# EAGLE design VMCustom (EAGLE 6.5.0)
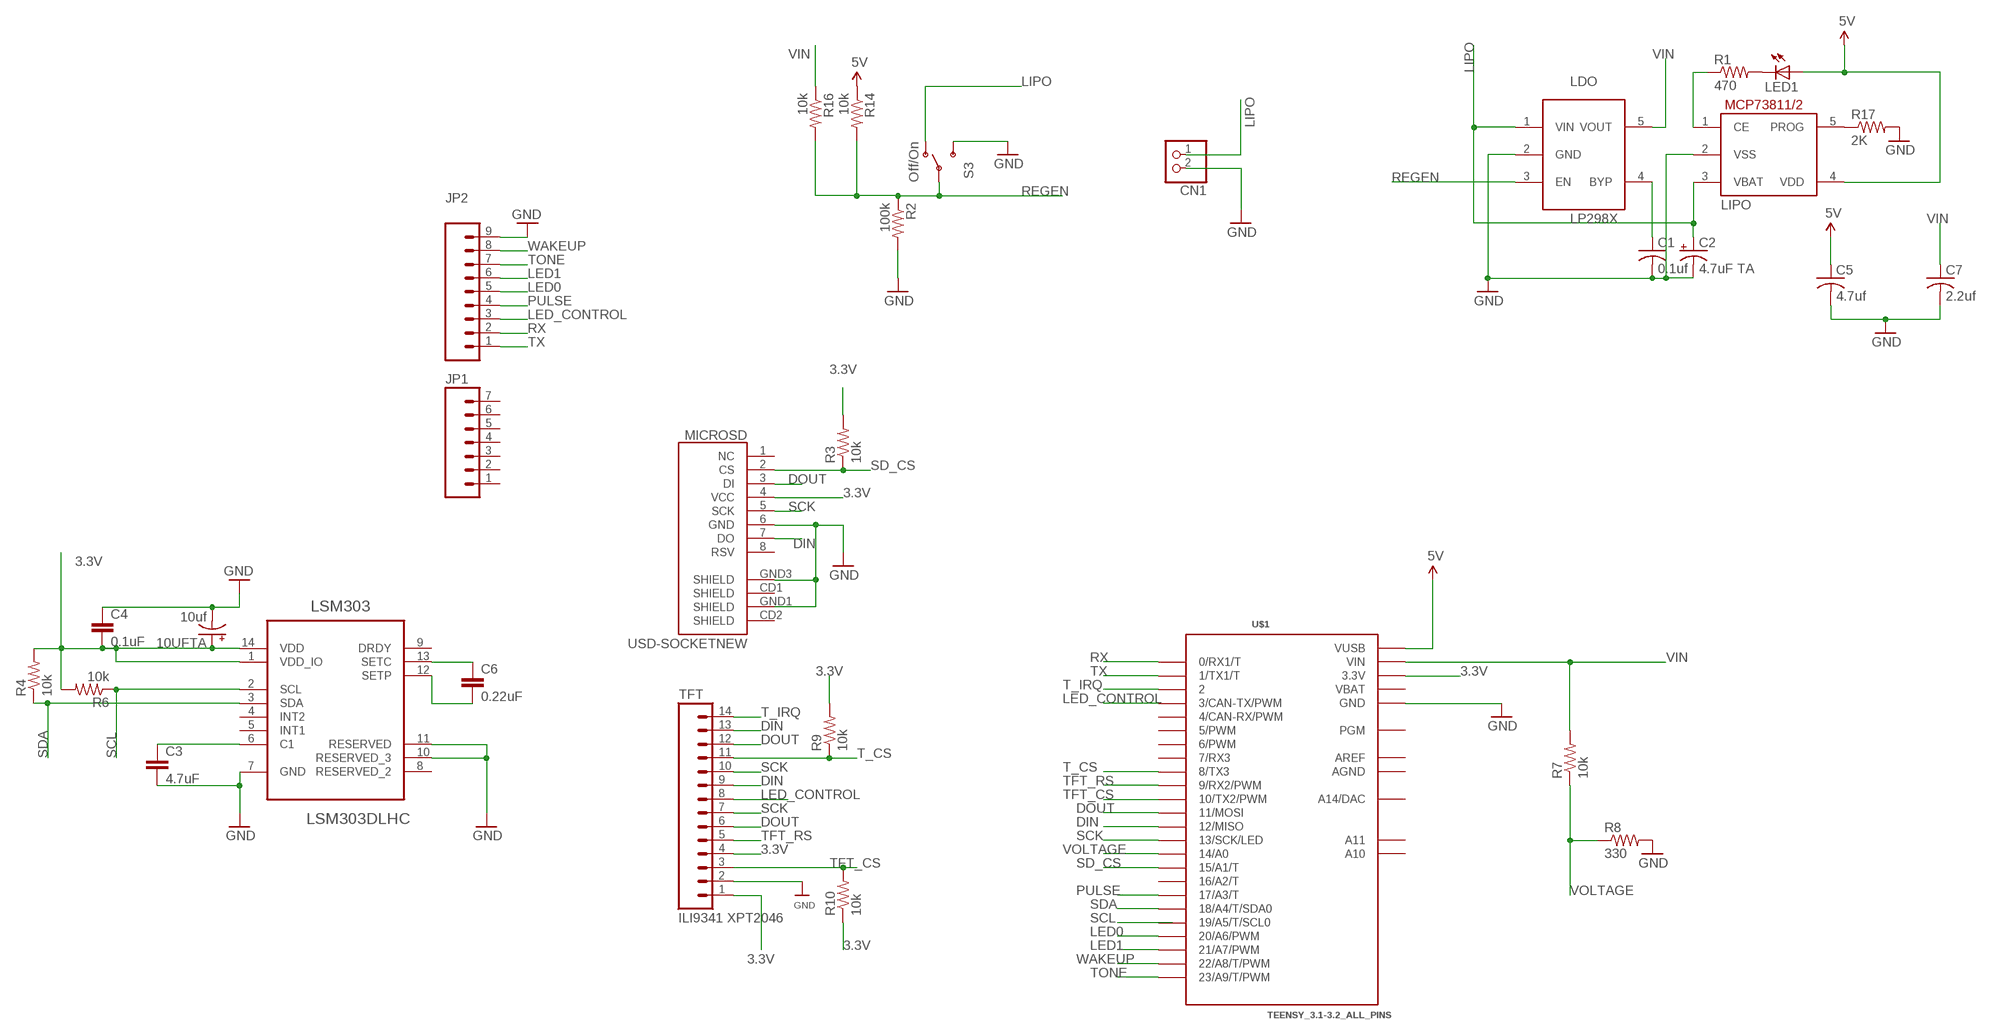
[diagram p0: schematic, sheet 1]

## Parts
10UFTA  10uf  CAP_POL6032  [EIA6032]
C1  0.1uf  C-USC0805K  [C0805K]
C2  4.7uF TA  10UF-16V-10%(TANT)  [EIA3216]
C3  4.7uF  CAP0805  [0805]
C4  0.1uF  CAP0805  [0805]
C5  4.7uf  C-USC0805K  [C0805K]
C6  0.22uF  CAP0805  [0805]
C7  2.2uf  C-USC0805K  [C0805K]
CN1  JST_2PIN-THM  [JST-PH-2-THM]
JP1  M07  [1X07]
JP2  M09NO_SILK  [1X09_NO_SILK]
LDO  LP298XS  [SOT23-5L]
LED1  LEDCHIPLED_0805  [CHIPLED_0805]
LIPO  MCP73811/2  [SOT23-5L]
LSM303  LSM303DLHC  [LGA14R80P1X6]
MICROSD  USD-SOCKETNEW  [MICRO-SD-SOCKET-PP]
R1  470  R-US_M0805  [M0805]
R2  100k  R-US_R0805  [R0805]
R3  10k  RESISTOR0805-RES  [0805]
R4  10k  RESISTOR0805-RES  [0805]
R6  10k  RESISTOR0805-RES  [0805]
R7  10k  RESISTOR0805-RES  [0805]
R8  330  RESISTOR0805-RES  [0805]
R9  10k  RESISTOR0805-RES  [0805]
R10  10k  RESISTOR0805-RES  [0805]
R14  10k  R-US_R0805  [R0805]
R16  10k  R-US_R0805  [R0805]
R17  2K  R-US_M0805  [M0805]
S3  Off/On  SWITCH-SPDT-SMD-A  [SWITCH-SPST-SMD-A]
TFT  ILI9341 XPT2046  M14  [1X14]
U$1  TEENSY_3.1-3.2_ALL_PINS  [TEENSY_3.0-3.2&LC_ALL_PINS]

## Nets
3.3V: 10UFTA.P$1(+) C4.2 LSM303.1(VDD_IO) LSM303.14(VDD) MICROSD.4(VCC) R3.2 R4.2 R6.2 R9.2 R10.1 TFT.1 TFT.4 U$1.3.3V U$1.3.3V1(3.3V)
5V [power]: C5.1 LED1.A LIPO.4(VDD) R14.1 U$1.VUSB
DIN: MICROSD.7(DO) TFT.9 TFT.13 U$1.12(12/MISO)
DOUT: MICROSD.3(DI) TFT.6 TFT.12 U$1.11(11/MOSI)
GND: 10UFTA.P$2(-) C1.2 C2.C(-) C3.2 C4.1 C5.2 C7.2 CN1.2 JP2.9 LDO.2(GND) LIPO.2(VSS) LSM303.7(GND) LSM303.10(RESERVED_3) LSM303.11(RESERVED) MICROSD.6(GND) MICROSD.GND1(SHIELD) MICROSD.GND3(SHIELD) R2.2 R8.2 R17.2 S3.3(S) TFT.2 U$1.GND U$1.GND1(GND)
LED0: JP2.5 U$1.20/A6(20/A6/PWM)
LED1: JP2.6 U$1.21/A7(21/A7/PWM)
LED_CONTROL: JP2.3 TFT.8 U$1.3(3/CAN-TX/PWM)
LIPO [power]: C2.A(+) CN1.1 LDO.1(VIN) LIPO.3(VBAT) S3.1(O)
N$1 [power]: LIPO.1(CE) R1.1
N$2: C3.1 LSM303.6(C1)
N$3: LED1.C R1.2
N$4: C1.1 LDO.4(BYP)
N$8: C6.1 LSM303.13(SETC)
N$10: C6.2 LSM303.12(SETP)
N$17 [power]: LIPO.5(PROG) R17.1
PULSE: JP2.4 U$1.17/A3(17/A3/T)
REGEN: LDO.3(EN) R2.1 R14.2 R16.2 S3.2(P)
RX: JP2.2 U$1.0(0/RX1/T)
SCK: MICROSD.5(SCK) TFT.7 TFT.10 U$1.13(13/SCK/LED)
SCL: LSM303.2(SCL) R6.1 U$1.19/A5(19/A5/T/SCL0)
SD_CS: MICROSD.2(CS) R3.1 U$1.15/A1(15/A1/T)
SDA: LSM303.3(SDA) R4.1 U$1.18/A4(18/A4/T/SDA0)
T_CS: R9.1 TFT.11 U$1.8(8/TX3)
T_IRQ: TFT.14 U$1.2
TFT_CS: R10.2 TFT.3 U$1.10(10/TX2/PWM)
TFT_RS: TFT.5 U$1.9(9/RX2/PWM)
TONE: JP2.7 U$1.23/A9(23/A9/T/PWM)
TX: JP2.1 U$1.1(1/TX1/T)
VIN: C7.1 LDO.5(VOUT) R7.2 R16.1 U$1.VIN
VOLTAGE: R7.1 R8.1 U$1.14/A0
WAKEUP: JP2.8 U$1.22/A8(22/A8/T/PWM)
Unconnected: JP1.1 JP1.2 JP1.3 JP1.4 JP1.5 JP1.6 JP1.7 LSM303.4(INT2) LSM303.5(INT1) LSM303.8(RESERVED_2) LSM303.9(DRDY) MICROSD.1(NC) MICROSD.8(RSV) MICROSD.CD1(SHIELD) MICROSD.CD2(SHIELD) U$1.4(4/CAN-RX/PWM) U$1.5(5/PWM) U$1.6(6/PWM) U$1.7(7/RX3) U$1.16/A2(16/A2/T) U$1.A10 U$1.A11 U$1.PGM U$1.RESET/DAC(A14/DAC)

## Power pins joined to a net without a drawn wire
AGND: U$1.AGND
AREF: U$1.AREF
VBAT: U$1.VBAT

## Library data of the parts
10UFTA = SparkFun-Passives:CAP_POL: Capacitor Polarized These are standard SMD and PTH capacitors. Normally 10uF, 47uF, and 100uF in electrolytic and tantalum varieties. Always verify the external diameter of the through hole cap, it varies with capacity, voltage, and manufacturer. The EIA devices should be standard.
C1 C5 C7 = adafruit:C-US: CAPACITOR, American symbol
C2 = SparkFun-Capacitors:10UF-16V-10%(TANT): CAP-00811 1206/EIA-3216 Tantalum capacitor; PROD_ID: CAP-00811; VALUE: 10uF
C3 C4 C6 = SparkFun:CAP: Capacitor Standard 0603 ceramic capacitor, and 0.1" leaded capacitor.
CN1 = adafruit:JST_2PIN: JST 2-Pin Connectors of various flavors SMT-RA (S2B-PH-SM4) 4UConnector #17311 SMT (B2B-PH-SM4) THM-RA (S2B-PH) THM (B2B-PH)
JP1 = SparkFun-Connectors:M07: Header 7 Standard 7-pin 0.1" header. Use with straight break away headers (SKU : PRT-00116), right angle break away headers (PRT-00553), swiss pins (PRT-00743), machine pins (PRT-00117), and female headers (PRT-00115). NOTES ON THE VARIANTS LOCK and LOCK_LONGPADS... This footprint was designed to help hold the alignment of a through-hole component (i.e. 7-pin header) while soldering it into place. You may notice that each hole has been shifted either up or down by 0.005 of an inch from it's more standard position (which is usually a perfectly straight line). This slight alteration caused the pins (the squares in the middle) to touch the edges of the holes. Because they are alternating, it causes a "brace" to hold the header in place. 0.005 has proven to be the perfect amount of "off-center" position when using our standard breakaway headers. Although looks a little odd when you look at the bare footprint, once you have a header in there, the alteration is very hard to notice. Also, if you push a header all the way into place, it is covered up entirely on the bottom side. This idea of altering the position of holes to aid alignment will be further integrated into the Sparkfun Library for other footprints. It can help hold any component with 3 or more connection pins.
JP2 = SparkFun-Connectors:M09: Header 9 Standard 9-pin 0.1" header. Use with straight break away headers (SKU : PRT-00116), right angle break away headers (PRT-00553), swiss pins (PRT-00743), machine pins (PRT-00117), and female headers (PRT-00115).
LDO = adafruit:LP298X
LED1 = led:LED: LED OSRAM: - CHIPLED LG R971, LG N971, LY N971, LG Q971, LY Q971, LO R971, LY R971 LH N974, LH R974 LS Q976, LO Q976, LY Q976 LO Q996 - Hyper CHIPLED LW Q18S LB Q993, LB Q99A, LB R99A - SideLED LS A670, LO A670, LY A670, LG A670, LP A670 LB A673, LV A673, LT A673, LW A673 LH A674 LY A675 LS A676, LA A676, LO A676, LY A676, LW A676 LS A679, LY A679, LG A679 - Hyper Micro SIDELED® LS Y876, LA Y876, LO Y876, LY Y876 LT Y87S - SmartLED LW L88C, LW L88S LB L89C, LB L89S, LG L890 LS L89K, LO L89K, LY L89K LS L896, LA L896, LO L896, LY L896 - TOPLED LS T670, LO T670, LY T670, LG T670, LP T670 LSG T670, LSP T670, LSY T670, LOP T670, LYG T670 LG T671, LOG T671, LSG T671 LB T673, LV T673, LT T673, LW T673 LH T674 LS T676, LA T676, LO T676, LY T676, LB T676, LH T676, LSB T676, LW T676 LB T67C, LV T67C, LT T67C, LS T67K, LO T67K, LY T67K, LW E67C LS E67B, LA E67B, LO E67B, LY E67B, LB E67C, LV E67C, LT E67C LW T67C LS T679, LY T679, LG T679 LS T770, LO T770, LY T770, LG T770, LP T770 LB T773, LV T773, LT T773, LW T773 LH T774 LS E675, LA E675, LY E675, LS T675 LS T776, LA T776, LO T776, LY T776, LB T776 LHGB T686 LT T68C, LB T68C - Hyper Mini TOPLED® LB M676 - Mini TOPLED Santana® LG M470 LS M47K, LO M47K, LY M47K Source: http://www.osram.convergy.de LUXEON: - LUMILED® LXK2-PW12-R00, LXK2-PW12-S00, LXK2-PW14-U00, LXK2-PW14-V00 LXK2-PM12-R00, LXK2-PM12-S00, LXK2-PM14-U00 LXK2-PE12-Q00, LXK2-PE12-R00, LXK2-PE12-S00, LXK2-PE14-T00, LXK2-PE14-U00 LXK2-PB12-K00, LXK2-PB12-L00, LXK2-PB12-M00, LXK2-PB14-N00, LXK2-PB14-P00, LXK2-PB14-Q00 LXK2-PR12-L00, LXK2-PR12-M00, LXK2-PR14-Q00, LXK2-PR14-R00 LXK2-PD12-Q00, LXK2-PD12-R00, LXK2-PD12-S00 LXK2-PH12-R00, LXK2-PH12-S00 LXK2-PL12-P00, LXK2-PL12-Q00, LXK2-PL12-R00 Source: www.luxeon.com KINGBRIGHT: KA-3528ASYC Source: www.kingbright.com
LIPO = adafruit:MCP73811/2: MCP73811 and MCP73812 Simple, Miniature Single-Cell, Fully Integrated Li-Ion / Li-Polymer Charge Management Controllers SOT-23-5 package, no indicator LED but with adjustable current, small and very inexpensive
LSM303 = LGA14R8OP1X6:LSM303DLHC: SENSOR, 3 CH, ACCEL, MAG, MOD, 14LGA; MPN: LSM303DLHC; OC_FARNELL: 2068595; OC_NEWARK: 73T6648; PACKAGE: LGA-14; SUPPLIER: STMicroelectronics
MICROSD = SparkFun-Connectors:USD-SOCKET: microSD Socket Push-push type uSD socket. Schematic element and footprint production proven. Spark Fun Electronics SKU : PRT-00127. tDoc lines correctly indicate media card edge positions when inserting (unlocked, locked, depressed).
R1 R2 R14 R16 R17 = adafruit:R-US_: RESISTOR, American symbol
R3 R4 R6-R10 = SparkFun-Resistors:RESISTOR: Resistor Basic schematic elements and footprints for 0603, 1206, and PTH resistors.
S3 = SparkFun-Electromechanical:SWITCH-SPDT: SPDT Switch Simple slide switch, Spark Fun Electronics SKU : COM-00102 DPDT SMT slide switch, AYZ0202, SWCH-08179
TFT = SparkFun-Connectors:M14: Header 14 Standard 14-pin 0.1" header. Use with straight break away headers (SKU : PRT-00116), right angle break away headers (PRT-00553), swiss pins (PRT-00743), machine pins (PRT-00117), and female headers (PRT-00115).
U$1 = Teensy_3_and_LC_Series_Boards_v1.4:TEENSY_3.1-3.2_ALL_PINS: Footprint for Teensy 3.1 or 3.2 board using all through-holes, i.e. the entire perimeter plus the 4 through-holes inboard (A10,A11,AREF, VUSB)

## Net classes
1 power: width 0.356 mm, drill 0.406 mm, clearance 0.355 mm to class 0, clearance 0.355 mm

## Board
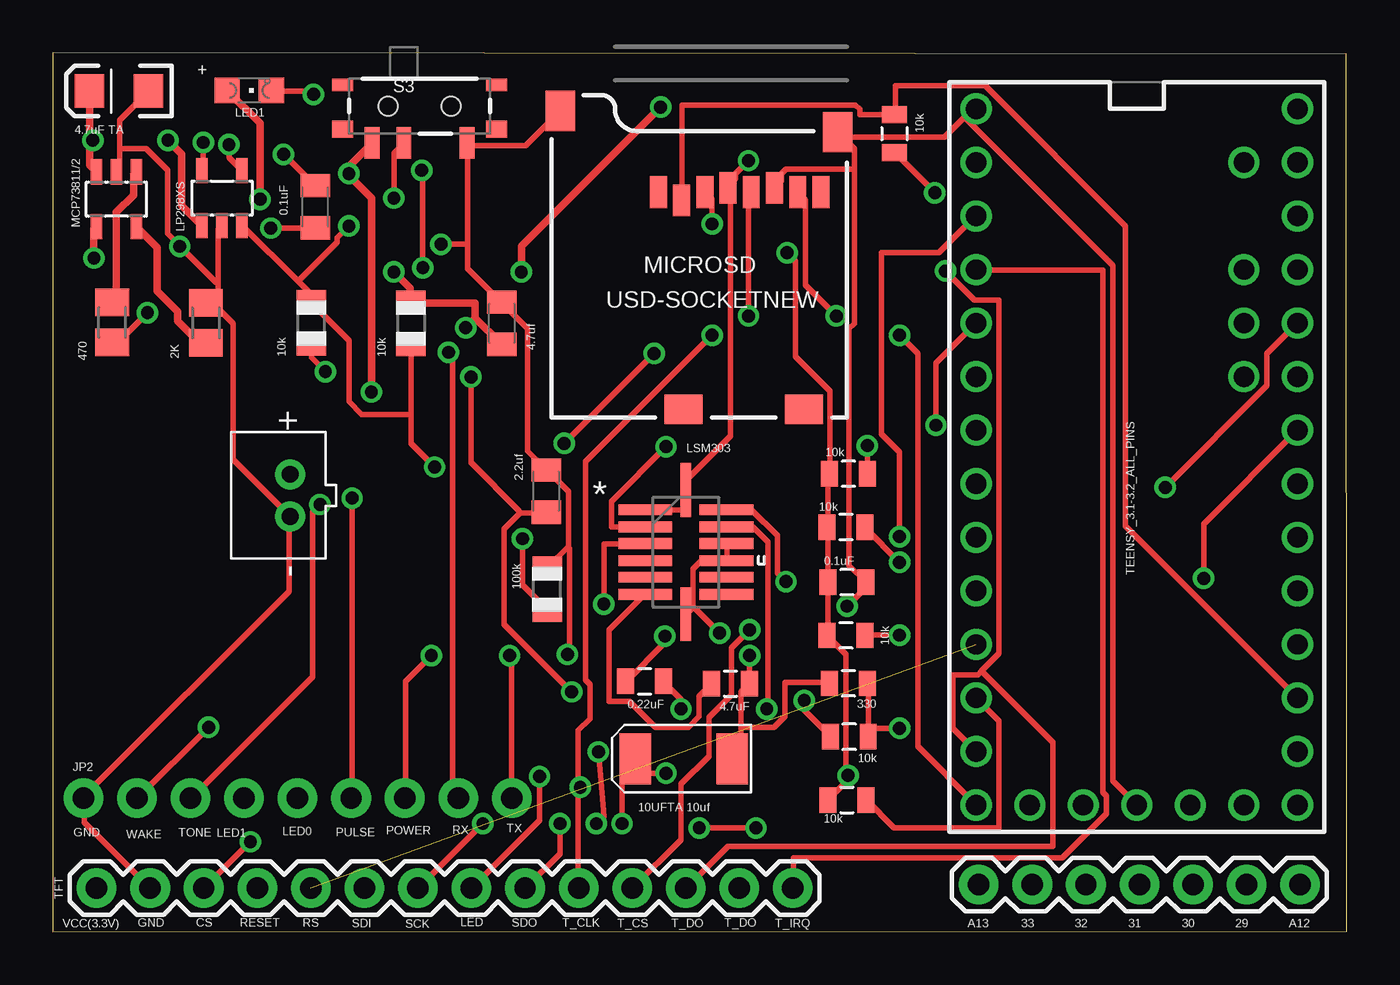
[diagram p1: board, top side]
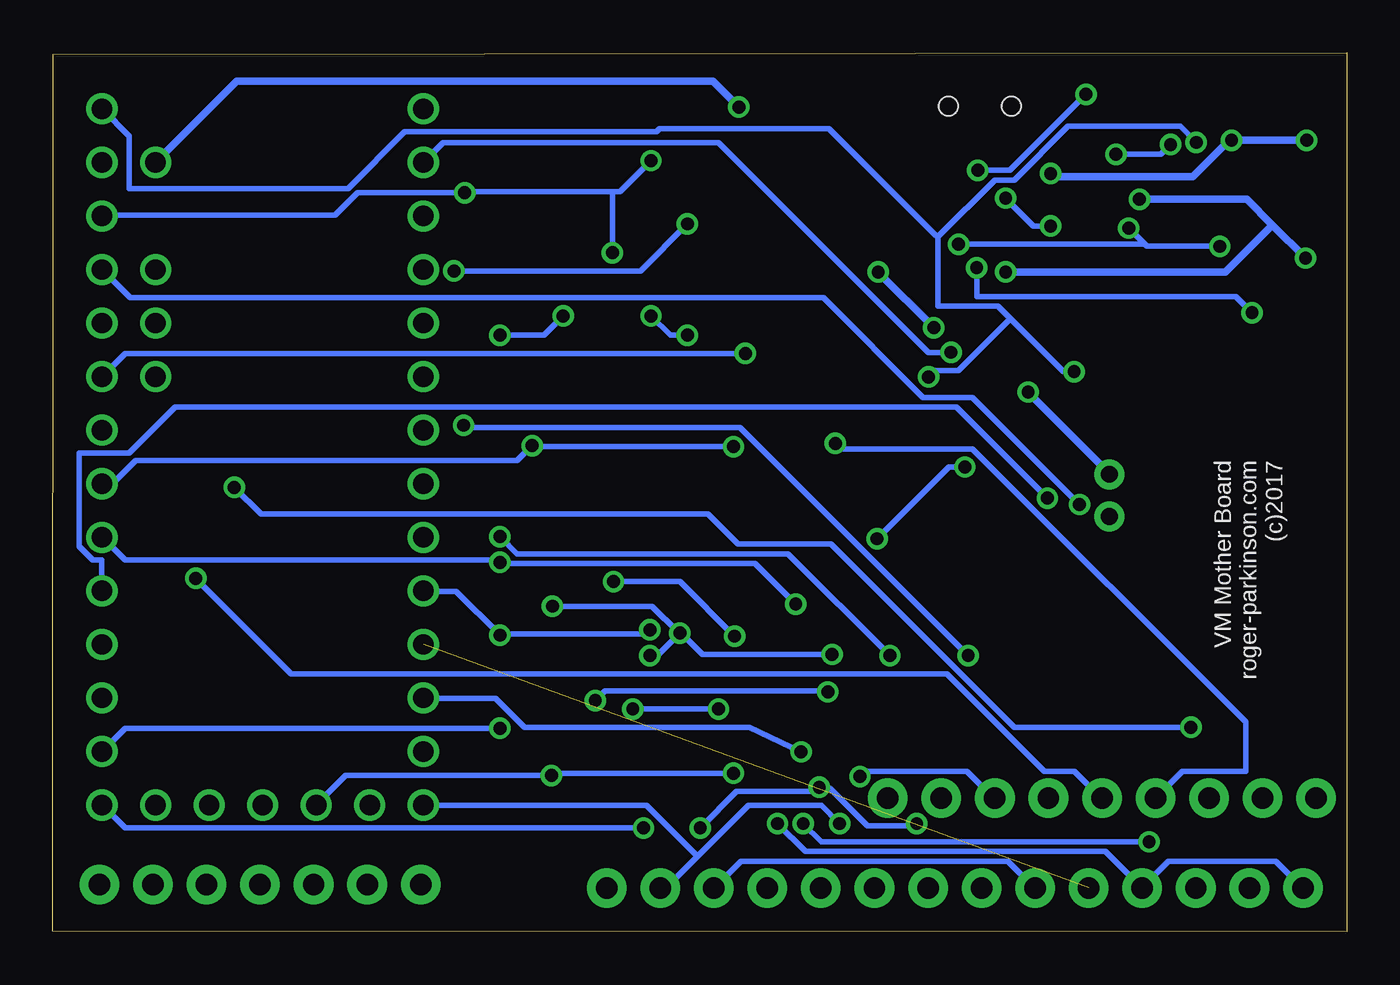
[diagram p2: board, bottom side, seen from below]

Size 61.37 x 41.7 mm. Coordinates in mm from the lower left corner, seen from the top.
Outline: 0,0 61.37,0.02 61.34,41.62 0,41.7 0,0
Copper layers (1*16): Top 0.035mm / dielectric 1.5mm / Bottom 0.035mm
Design rules "default": minimum track width 10mil, minimum drill 24mil, track to track 8mil, track to pad 8mil, pad to pad 8mil, via to via 8mil, smd to smd 8mil, copper to edge 40mil, drill to drill 8mil, minimum pad ring 10mil, minimum via ring 8mil, stop-mask expansion 4mil, vias tented up to drill 0mil, thermal gap 10mil

### Footprints (pad centres in the part's own frame; a part is rotated, then mirrored left to right if it is on the bottom)
EIA6032 = smd 1.5 x 2.4: P$1 -2.3,0; P$2 2.3,0
C0805K = smd 1.1 x 1.4: 1 -1,0; 2 1,0
EIA3216 = smd 1.4 x 1.6: A 1.4,0; C -1.4,0
0805 = smd 0.8 x 1.2: 1 -0.9,0; 2 0.9,0
JST-PH-2-THM = drill 0.8 pad 1.422: 1 1,0; 2 -1,0
1X07 = drill 1.016 pad 1.88: 1 0,0; 2 2.54,0; 3 5.08,0; 4 7.62,0; 5 10.16,0; 6 12.7,0; 7 15.24,0
1X09_NO_SILK = drill 1.016 pad 1.88: 1 0,0; 2 2.54,0; 3 5.08,0; 4 7.62,0; 5 10.16,0; 6 12.7,0; 7 15.24,0; 8 17.78,0; 9 20.32,0
SOT23-5L = smd 0.55 x 1.2: 1 -0.95,-1.3; 2 0,-1.3; 3 0.95,-1.3; 4 0.95,1.3; 5 -0.95,1.3
CHIPLED_0805 = smd 1.2 x 1.2: A 0,-1.05; C 0,1.05
LGA14R80P1X6 = smd 2.54 x 0.508: 1 -1.93,2.007; 2 -1.93,1.194; 3 -1.93,0.406; 4 -1.93,-0.406; 5 -1.93,-1.194; 6 -1.93,-2.007; 8 1.93,-2.007; 9 1.93,-1.194; 10 1.93,-0.406; 11 1.93,0.406; 12 1.93,1.194; 13 1.93,2.007 | smd 0.508 x 2.54: 7 0,-2.946; 14 0,2.946
MICRO-SD-SOCKET-PP = smd 0.8 x 1.5: 1 -8.94,10.7; 2 -7.84,10.3; 3 -6.74,10.7; 4 -5.64,10.9; 5 -4.54,10.7; 6 -3.44,10.9; 7 -2.34,10.7; 8 -1.24,10.7 | smd 1.8 x 1.4: CD1 -2.05,0.4; CD2 -7.75,0.4 | smd 1.4 x 1.9: GND1 -13.6,14.55; GND3 -0.45,13.55
M0805 = smd 1.3 x 1.6: 1 -0.95,0; 2 0.95,0
R0805 = smd 1.1 x 1.4: 1 -1,0; 2 1,0
SWITCH-SPST-SMD-A = smd 0.7 x 1.5: 1 -2.25,-1.75; 2 -0.75,-1.75; 3 2.25,-1.75 | smd 1 x 0.6: GND1 -3.65,1; GND3 3.65,1 | smd 1 x 0.8: GND2 -3.65,-1.1; GND4 3.65,-1.1 | hole 0.9: -1.5,0; 1.5,0
1X14 = drill 1.016 pad 1.88: 1 0,0; 2 2.54,0; 3 5.08,0; 4 7.62,0; 5 10.16,0; 6 12.7,0; 7 15.24,0; 8 17.78,0; 9 20.32,0; 10 22.86,0; 11 25.4,0; 12 27.94,0; 13 30.48,0; 14 33.02,0
TEENSY_3.0-3.2&LC_ALL_PINS = drill 0.965: 0 -7.62,13.97; 1 -7.62,11.43; 2 -7.62,8.89; 3 -7.62,6.35; 3.3V 7.62,11.43; 3.3V1 -2.54,-16.51; 4 -7.62,3.81; 5 -7.62,1.27; 6 -7.62,-1.27; 7 -7.62,-3.81; 8 -7.62,-6.35; 9 -7.62,-8.89; 10 -7.62,-11.43; 11 -7.62,-13.97; 12 -7.62,-16.51; 13 7.62,-16.51; 14/A0 7.62,-13.97; 15/A1 7.62,-11.43; 16/A2 7.62,-8.89; 17/A3 7.62,-6.35; 18/A4 7.62,-3.81; 19/A5 7.62,-1.27; 20/A6 7.62,1.27; 21/A7 7.62,3.81; 22/A8 7.62,6.35; 23/A9 7.62,8.89; A10 5.08,6.35; A11 5.08,3.81; AGND 7.62,13.97; AREF 5.08,8.89; GND -7.62,16.51; GND1 0,-16.51; PGM 2.54,-16.51; RESET/DAC 5.08,-16.51; VBAT -5.08,-16.51; VIN 7.62,16.51; VUSB 5.08,13.97

### Placement (x,y rotation side)
10UFTA  29.92,8.2 0 top
C1  12.45,34.39 270 top
C2  3.15,39.88 180 top
C3  32.14,11.77 0 top
C4  37.66,16.58 180 top
C5  21.3,28.86 90 top
C6  28.07,11.88 0 top
C7  23.4,20.9 90 top
CN1  11.25,20.7 90 top
JP1  43.92,2.24 0 top
JP2  21.77,6.33 180 top
LDO  8.03,34.8 0 top
LED1  9.32,39.9 270 top
LIPO  3.02,34.75 180 top
LSM303  30.02,18.01 0 top
MICROSD  37.67,24.38 0 top
R1  2.82,28.91 270 top
R2  23.44,16.26 90 top
R3  39.91,37.85 270 top
R4  37.62,19.19 180 top
R6  37.74,21.72 180 top
R7  37.77,9.25 180 top
R8  37.74,11.79 180 top
R9  37.61,14.05 180 top
R10  37.66,6.25 0 top
R14  16.99,28.85 270 top
R16  12.27,28.88 90 top
R17  7.26,28.88 90 top
S3  17.4,39.17 0 top
TFT  2.08,2.08 0 top
U$1  51.41,22.52 0 top

### Tracks (layer width: path | path; a pad name or v marks a point on that pad's centre or on a via)
3.3V  (via drill 0.61)
  Top 0.254: LSM303.1 29.95,20.02 29.95,20.88 LSM303.14 30.05,20.98 30.05,21.44 32.13,23.52 32.13,35.15 32.03,35.26 MICROSD.4 32.08,35.41 32.38,35.71 32.38,35.97 v32.99,36.58 | v41.83,35.05 39.95,36.93 R3.2 | 37.62,7.42 37.62,13.16 36.8,13.97 R9.2 36.75,14.07 36.75,16.56 C4.2 36.75,16.66 36.75,19.15 R4.2 36.75,19.3 36.75,21.64 36.8,21.69 R6.2 36.86,21.84 36.86,25.65 35.23,27.28 35.23,31.8 v34.82,32.21 | 37.62,7.42 37.62,7.11 36.8,6.3 R10.1 | v37.72,7.42 37.62,7.42 | v27,5.13 27,7.57 27.61,8.18 10UFTA.P$1 27.1,7.52 v29.08,7.52
  Bottom 0.254: U$1.3.3V 59,33.99 47.98,33.99 46.91,35.05 v41.83,35.05 41.73,35.1 34.82,35.1 | v32.99,36.58 34.47,35.1 34.82,35.1 | U$1.3.3V1 48.84,6.05 47.47,7.42 v37.72,7.42 37.62,7.47 37.57,7.52 v29.08,7.52 | v27,5.13 25.68,3.81 11.46,3.81 9.73,2.08 TFT.4 9.63,2.18 8.46,3.35 3.38,3.35 2.11,2.08 TFT.1 | v34.82,32.21 34.82,35.1
5V  (via drill 0.61)
  Top 0.356: v1.96,31.95 1.96,33.33 2.06,33.43 LIPO.4 | v9.83,34.75 9.83,38.35 8.31,39.88 LED1.A | 20.04,29.11 20.04,29.82 16.99,29.82 R14.1 16.94,30.02 16.94,30.53 v16.18,31.29 | 20.04,29.11 21.26,27.89 C5.1 | v28.83,39.12 22.22,32.51 v22.22,31.29 | 20.04,29.11 v19.58,28.65
  Bottom 0.356: 3.53,33.53 4.75,34.75 v9.83,34.75 | 3.53,33.53 v1.96,31.95 | v28.83,39.12 30.05,40.34 52.65,40.34 56.46,36.53 U$1.VUSB | v19.58,28.65 v22.22,31.29 | 3.53,33.53 5.77,31.29 v16.18,31.29
DIN  (via drill 0.61)
  Top 0.254: v24.05,5.13 24.05,3.71 22.43,2.08 TFT.9 | v37.16,29.21 35.69,30.68 35.69,34.7 35.33,35.05 MICROSD.7 | v40.16,28.3 41.02,27.43 41.02,8.79 43.76,6.05 U$1.12
  Bottom 0.254: v24.05,5.13 24.92,5.99 28.37,5.99 30.78,3.58 | 30.78,3.58 32.28,2.08 32.54,2.08 TFT.13 | v37.16,29.21 38.07,28.3 v40.16,28.3 | 30.78,3.58 33.2,5.99 43.76,5.99 U$1.12
DOUT  (via drill 0.61)
  Top 0.254: v31.27,33.58 31.27,34.75 30.96,35.05 MICROSD.3 | v42.34,31.34 43.71,29.97 44.88,29.97 44.88,13.21 44.04,12.37 | 44.04,12.37 43.87,12.19 42.7,12.19 42.7,9.65 43.76,8.59 U$1.11 | 44.04,12.37 47.42,8.99 47.42,4.06 32.03,4.06 30.05,2.08 TFT.12
  Bottom 0.254: TFT.6 14.81,2.08 16.08,3.35 28.73,3.35 30,2.08 TFT.12 | v31.27,33.58 33.5,31.34 v42.34,31.34
GND  (via drill 0.61)
  Top 0.254: 30.35,15.39 LSM303.7 | 30.35,15.39 30.35,17.22 30.71,17.58 31.93,17.58 LSM303.10 31.98,17.68 31.98,18.39 LSM303.11 | 32.64,9.7 32.64,8.64 32.23,8.23 10UFTA.P$2 | 32.64,9.7 32.64,11.38 32.99,11.74 C3.2 33.05,11.89 v33.05,13.11 | 32.64,9.7 34.21,9.7 34.72,10.21 34.72,11.84 36.8,11.84 R8.2 | v31.62,14.17 30.45,15.34 30.35,15.39 | 51.43,5.99 U$1.GND1 51.33,6.1 50.27,7.16 50.27,31.6 43.31,38.56 U$1.GND | 43.81,39.01 U$1.GND | 38.02,36.17 38.02,37.14 37.26,37.9 MICROSD.GND3 37.62,37.69 42.29,37.69 43.66,39.07 U$1.GND | 38.02,36.17 38.02,28.85 37.77,28.6 37.77,17.37 38.53,16.61 C4.1 38.53,16.46 38.53,16.31 v37.67,15.44 | 38.02,36.17 34.77,36.17 34.57,35.97 34.57,35.61 34.26,35.31 MICROSD.6 | 24.46,18.29 24.46,20.88 23.44,21.9 C7.2 23.34,22 22.53,22.81 22.53,28.6 21.36,29.77 C5.2 21.26,29.87 19.68,31.45 19.68,32.61 | 24.46,18.29 23.44,17.27 R2.2 | 19.68,32.61 19.68,37.39 S3.3 19.79,37.29 22.43,37.29 24.05,38.91 MICROSD.GND1 | TFT.2 4.6,2.08 1.5,5.18 1.5,6.3 JP2.9 1.5,6.45 11.2,16.15 11.2,19.61 CN1.2 8.56,22.4 8.56,28.85 7.49,29.92 R17.2 7.29,29.87 7.85,30.43 7.85,30.79 | 3.17,37.14 3.17,38.51 C2.C | 3.17,37.14 3.17,36.22 3.02,36.07 LIPO.2 | 7.85,30.79 7.85,33.33 8,33.48 LDO.2 | v10.34,33.38 12.42,33.38 C1.2 | 7.85,30.79 7.75,30.79 v6.02,32.51 5.97,32.61 5.46,33.12 5.46,36.12 4.44,37.14 3.17,37.14 | v18.41,32.61 19.68,32.61 | v24.41,13.16 24.51,13.26 24.51,18.19 24.46,18.29
  Bottom 0.254: v31.62,14.17 32.69,13.11 v33.05,13.11 | v37.67,15.44 32.94,15.44 31.72,14.22 v31.62,14.17 | 9.65,32.69 9.47,32.51 v6.02,32.51 | 9.65,32.69 v10.34,33.38 | v18.41,32.61 9.73,32.61 9.65,32.69 | v24.41,13.16 30.56,13.16 31.52,14.12 v31.62,14.17
LED0  (via drill 0.61)
  Top 0.254: v54.58,16.76 54.58,19.36 59,23.77 U$1.20/A6
  Bottom 0.254: v54.58,16.76 50.06,12.24 18.97,12.24 14.35,7.62 12.93,7.62 11.66,6.35 JP2.5
LED1  (via drill 0.61)
  Top 0.254: v24.26,23.17 v28.52,27.43
  Bottom 0.254: v28.52,27.43 57.94,27.43 59,26.37 U$1.21/A7 | v24.26,23.17 24,22.91 17.75,22.91 4.8,9.96 4.8,7.62 7.8,7.62 9.07,6.35 JP2.6
LED_CONTROL  (via drill 0.61)
  Top 0.254: v41.88,24.03 41.88,26.98 43.76,28.85 U$1.3 | v17.96,13.11 16.74,11.89 16.74,6.35 JP2.3 | v23.09,7.37 23.09,5.28 19.89,2.08 TFT.8
  Bottom 0.254: v41.88,24.03 41.78,23.93 28.78,23.93 v17.96,13.11 | v23.09,7.37 22.83,7.62 18.01,7.62 16.74,6.35 JP2.3
LIPO  (via drill 0.61)
  Top 0.356: 1.75,37.54 C2.A | 1.75,37.54 1.75,36.37 2.06,36.07 LIPO.3 | v5.46,37.54 6.12,36.88 6.12,34.44 7.04,33.53 LDO.1 | v1.9,37.54 1.75,37.54 | S3.1 15.11,37.39 14.05,36.32 v14.05,35.97 14.1,35.81 15.11,34.8 v15.11,25.6
  Bottom 0.356: v1.9,37.54 v5.46,37.54 5.61,37.49 7.29,35.81 13.89,35.81 v14.05,35.97 | v15.11,25.6 11.25,21.74 CN1.1
N$1
  Top 0.356: LIPO.1 3.94,36.02 3.84,35.92 3.84,34.95 3.02,34.14 3.02,30.07 2.82,29.87 R1.1
N$2
  Top 0.254: C3.1 31.22,11.74 30.66,11.18 30.66,10.21 30.15,9.7 28.57,9.7 27.36,10.92 26.39,10.92 26.39,14.33 28.07,16 LSM303.6
N$3  (via drill 0.61)
  Top 0.254: v12.37,39.73 12.37,39.88 10.39,39.88 LED1.C | v17.5,36.12 17.55,36.07 v17.55,31.5 | v4.5,29.36 3.12,27.99 2.82,27.99 R1.2
  Bottom 0.254: v12.37,39.73 15.98,36.12 v17.5,36.12 | v17.55,31.5 17.55,30.12 5.26,30.12 v4.5,29.36
N$4  (via drill 0.61)
  Top 0.254: v8.36,37.34 8.36,36.73 8.97,36.12 LDO.4 | v10.95,36.88 12.42,35.41 C1.1
  Bottom 0.254: v8.36,37.34 8.81,36.88 v10.95,36.88
N$8  (via drill 0.61)
  Top 0.254: v29.03,14.02 29.03,13.72 27.2,11.89 C6.1 | v34.77,16.61 34.37,17.02 34.37,18.8 33.15,20.02 LSM303.13
  Bottom 0.254: v29.03,14.02 31.62,16.61 v34.77,16.61
N$10  (via drill 0.61)
  Top 0.254: v29.79,10.57 29.79,11.02 28.98,11.84 C6.2 | v33.86,10.57 33.91,10.62 33.91,18.49 33.2,19.2 LSM303.12
  Bottom 0.254: v33.86,10.57 v29.79,10.57
N$17
  Top 0.356: LIPO.5 3.99,33.43 4.95,32.46 4.95,30.38 5.92,29.41 5.92,28.96 6.93,27.94 7.24,27.94 R17.1
PULSE  (via drill 0.61)
  Top 0.254: v14.2,20.57 14.2,6.35 JP2.4
  Bottom 0.254: v14.2,20.57 18.52,24.89 55.55,24.89 57.73,22.71 60.12,22.71 60.12,18.29 59.46,17.63 59.05,17.63 59.05,16.21 U$1.17/A3
REGEN  (via drill 0.61)
  Top 0.254: 11.63,30.86 12.27,30.23 R16.2 12.32,29.77 14.05,28.04 14.05,25.15 14.66,24.54 16.99,24.54 | 11.63,30.86 9.02,33.48 LDO.3 | v16.18,34.8 16.18,36.93 16.64,37.39 S3.2 | v14.05,33.48 13.49,32.92 13.49,32.72 11.63,30.86 | v22.28,18.64 22.28,16.46 23.44,15.29 R2.1 | v18.11,22.05 16.99,23.17 16.99,24.54 | R14.2 16.99,24.54
  Bottom 0.254: v16.18,34.8 14.86,33.48 v14.05,33.48 | v22.28,18.64 18.87,22.05 v18.11,22.05
RX  (via drill 0.61)
  Top 0.254: v18.77,27.48 18.97,27.28 18.97,6.6 19.23,6.35 JP2.2
  Bottom 0.254: v18.77,27.48 19.84,27.48 29.79,37.44 42.85,37.44 43.76,36.53 U$1.0
SCK  (via drill 0.61)
  Top 0.254: MICROSD.5 32.99,34.95 v32.99,29.21 | v31.27,28.3 25.27,22.3 25.27,11.94 25.48,11.74 25.48,10.11 24.92,9.55 24.92,6.86 | 24.92,6.86 24.92,2.08 TFT.10 | v30.66,4.93 v33.35,4.93 | v25.02,6.86 24.92,6.86 | v20.4,5.13 17.35,2.08 TFT.7
  Bottom 0.254: v32.99,29.21 32.08,28.3 v31.27,28.3 | v33.35,4.93 57.94,4.93 59,5.99 U$1.13 | v30.66,4.93 28.93,6.66 25.22,6.66 v25.02,6.86 24.92,6.81 24.51,6.81 22.73,5.03 20.5,5.03 v20.4,5.13
SCL  (via drill 0.61)
  Top 0.254: v38.63,23.06 38.63,21.74 R6.1 | LSM303.2 26.49,19.2 26.49,20.42 v29.08,23.01
  Bottom 0.254: U$1.19/A5 59,21.29 58.5,21.29 57.43,22.35 39.34,22.35 v38.63,23.06 38.53,23.01 v29.08,23.01
SD_CS
  Top 0.254: MICROSD.2 29.84,34.7 29.84,39.22 38.07,39.22 38.28,39.01 38.28,38.76 39.9,38.76 R3.1 39.95,38.86 39.95,40.13 44.22,40.13 50.88,33.48 50.88,19.25 59,11.13 U$1.15/A1
SDA  (via drill 0.61)
  Top 0.254: v40.16,17.53 38.53,19.15 R4.1 | v26.14,15.55 26.14,18.39 28.07,18.39 LSM303.3
  Bottom 0.254: U$1.18/A4 59,18.69 57.94,17.63 40.26,17.63 v40.16,17.53 40.06,17.48 28.07,17.48 v26.14,15.55
T_CS  (via drill 0.61)
  Top 0.254: v40.16,14.07 38.53,14.07 R9.1 | v33.05,14.33 32.18,13.46 32.18,11.23 31.11,10.16 31.11,8.33 29.79,7.01 29.79,4.37 27.51,2.08 TFT.11
  Bottom 0.254: U$1.8 43.76,16.15 42.24,16.15 v40.16,14.07 40.06,14.12 33.25,14.12 v33.05,14.33
T_IRQ
  Top 0.254: U$1.2 43.81,31.39 49.81,31.39 49.81,6.6 49.96,6.45 49.96,5.59 47.88,3.51 35.13,3.51 35.13,2.08 TFT.14
TFT_CS  (via drill 0.61)
  Top 0.254: R10.2 38.58,6.25 39.9,4.93 44.88,4.93 44.88,10.01 43.81,11.07 U$1.10 | v9.37,4.27 7.19,2.08 TFT.3 | v25.78,5.13 26.14,5.49 v25.88,8.53
  Bottom 0.254: v9.37,4.27 24.92,4.27 v25.78,5.13 | v25.88,8.53 28.32,9.7 38.99,9.7 40.36,11.07 43.76,11.07 U$1.10
TFT_RS  (1 unrouted)
TONE  (via drill 0.61)
  Top 0.254: v12.67,20.27 12.32,19.91 12.32,12.09 6.58,6.35 JP2.7
  Bottom 0.254: v12.67,20.27 17.75,25.35 20.09,25.35 24.82,30.07 57.68,30.07 59,31.39 U$1.23/A9
TX  (via drill 0.61)
  Top 0.254: v40.16,18.75 40.16,22.76 39.29,23.62 39.29,32.21 42.04,32.21 43.76,33.93 U$1.1 | v21.67,13.11 21.77,13.01 21.77,6.35 JP2.1
  Bottom 0.254: v40.16,18.75 39.34,17.93 26.49,17.93 v21.67,13.11
VIN  (via drill 0.61)
  Top 0.254: v35.64,10.97 35.64,10.52 36.86,9.3 R7.2 | v24.61,11.38 21.41,14.58 21.41,19.1 22.17,19.86 | 22.17,19.86 23.39,19.86 C7.1 | v7.14,37.44 7.14,36.17 7.09,36.12 LDO.5 | v12.93,26.57 12.27,27.23 R16.1 | v19.84,26.31 19.84,22.25 22.12,19.96 22.17,19.86
  Bottom 0.254: v35.64,10.97 35.18,11.43 24.66,11.43 v24.61,11.38 | v7.14,37.44 7.9,38.2 13.23,38.2 15.77,35.66 16.69,35.66 19.38,32.97 | 19.38,32.97 19.38,29.67 16.54,29.67 15.95,29.08 | 15.95,29.08 13.44,26.57 v12.93,26.57 | U$1.VIN 59,39.01 57.73,37.74 57.73,35.26 47.37,35.26 44.68,37.95 32.74,37.95 32.59,38.1 24.56,38.1 19.48,33.02 19.38,32.97 | v19.84,26.31 19.53,26.62 18.41,26.62 15.95,29.08
VOLTAGE  (via drill 0.61)
  Top 0.254: R8.1 38.68,11.79 38.68,9.3 R7.1 38.79,9.65 v40.16,9.65
  Bottom 0.254: v40.16,9.65 57.94,9.65 59,8.59 U$1.14/A0
WAKEUP  (via drill 0.61)
  Top 0.254: v52.76,21.08 57.58,25.91 57.58,27.43 59,28.85 U$1.22/A8 | v7.39,9.7 4.04,6.35 JP2.8
  Bottom 0.254: v52.76,21.08 51.49,19.81 30.3,19.81 28.88,18.39 24.46,18.39 15.77,9.7 v7.39,9.7

### Text on the board
tNames: + | 0.1uF | 10UFTA 10uf | GND | TONE | LED1 | LED0 | PULSE | POWER | RX | TX | WAKE | VCC(3.3V) | GND | CS | RESET | RS | SDI | SCK | LED | SDO | T_CLK | T_CS | T_DO | T_DO | T_IRQ | A13 | 33 | 32 | 31 | 30 | 29 | A12
bNames: VM Mother Board / roger-parkinson.com / (c)2017